# Altium schematic sheet NB2DSK01.SchDoc: NANOBOARD 2 - DESKTOP
size A3; Organization: Altium Limited.; Address1: Level 3, 12a Rodborough Rd; Address2: Frenchs Forest 2086; Address3: NSW; Address4: AUSTRALIA; DocumentNumber: 1; Revision: 6; SheetNumber: 1; SheetTotal: 64; PageSetup: Record=PageOptions|CenterHorizontal=True|CenterVertical=True|PrintScale=0.67|XCorrection=1.00|YCorrection=1.00|PrintKind=0|BorderSize=5000000|LeftOffset=0|BottomOffset=0|Orientation=1|PaperLength=4200|PaperWidth=2969|Scale=100|PaperSource=7|PrintQuality=1200|MediaType=1|DitherType=10|PaperKind=A4 (210 x 297 mm)|PrintScaleMode=1
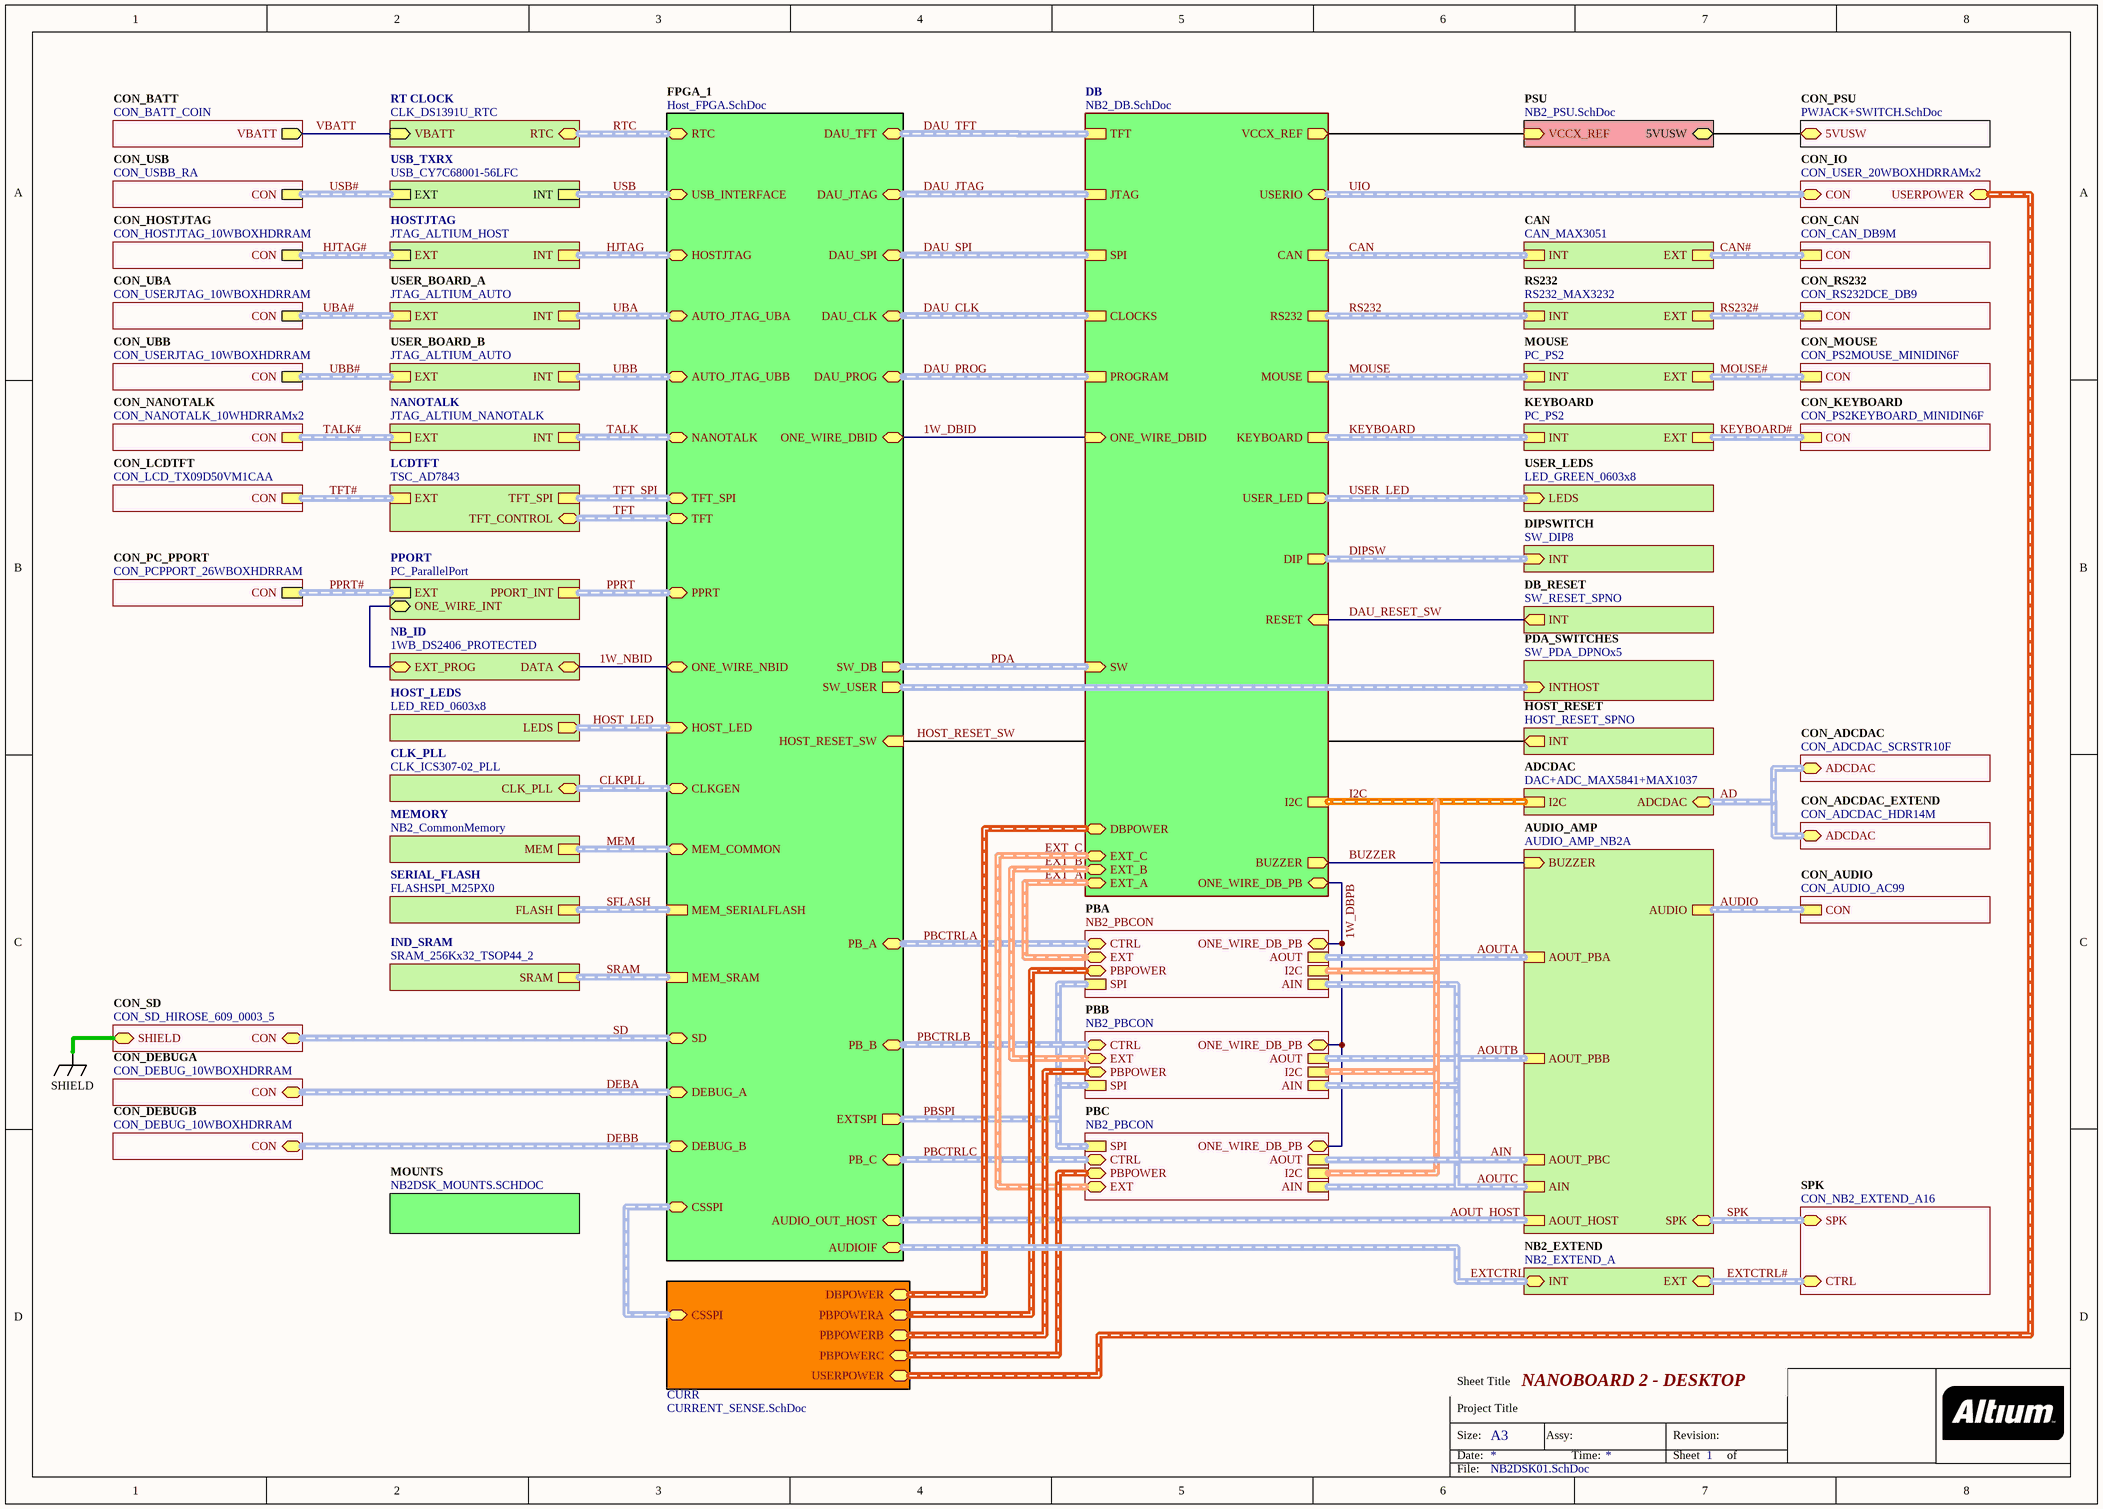
[diagram p0: NB2DSK01.SchDoc]

## Sub-sheets
ADCDAC = DAC+ADC_MAX5841+MAX1037: I2C (harness I2C), ADCDAC (harness ADCDAC)
AUDIO_AMP = AUDIO_AMP_NB2A: BUZZER (in), AIN (harness AUDIO_IN), AOUT_PBC (harness AUDIO_OUT), AOUT_PBA (harness AUDIO_OUT), AOUT_PBB (harness AUDIO_OUT), AOUT_HOST (harness AUDIO_OUT), AUDIO (harness AUDIO_EXT), SPK (harness NB2_SPEAKER)
CAN = CAN_MAX3051: EXT (harness CAN_EXT), INT (harness CAN_INT)
CLK_PLL = CLK_ICS307-02_PLL: CLK_PLL (harness CLK_PLL)
CON_ADCDAC = CON_ADCDAC_SCRSTR10F: ADCDAC (harness ADCDAC)
CON_ADCDAC_EXTEND = CON_ADCDAC_HDR14M: ADCDAC (harness ADCDAC)
CON_AUDIO = CON_AUDIO_AC99: CON (harness AUDIO_EXT)
CON_BATT = CON_BATT_COIN: VBATT (out)
CON_CAN = CON_CAN_DB9M: CON (harness CAN_EXT)
CON_DEBUGA = CON_DEBUG_10WBOXHDRRAM: CON (harness DBHDR)
CON_DEBUGB = CON_DEBUG_10WBOXHDRRAM: CON (harness DBHDR)
CON_HOSTJTAG = CON_HOSTJTAG_10WBOXHDRRAM: CON (harness HARDSOFT_JTAG)
CON_IO = CON_USER_20WBOXHDRRAMx2: CON (harness IO36), USERPOWER (harness USERPOWER)
CON_KEYBOARD = CON_PS2KEYBOARD_MINIDIN6F: CON (harness PS2)
CON_LCDTFT = CON_LCD_TX09D50VM1CAA: CON (harness LCD)
CON_MOUSE = CON_PS2MOUSE_MINIDIN6F: CON (harness PS2)
CON_NANOTALK = CON_NANOTALK_10WHDRRAMx2: CON (harness NANOTALK)
CON_PC_PPORT = CON_PCPPORT_26WBOXHDRRAM: CON (harness PPORT_CON)
CON_PSU = PWJACK+SWITCH.SchDoc: 5VUSW (bidir)
CON_RS232 = CON_RS232DCE_DB9: CON (harness RS232_EXT)
CON_SD = CON_SD_HIROSE_609_0003_5: CON (harness SD), SHIELD
CON_UBA = CON_USERJTAG_10WBOXHDRRAM: CON (harness JTAG_CONFIG)
CON_UBB = CON_USERJTAG_10WBOXHDRRAM: CON (harness JTAG_CONFIG)
CON_USB = CON_USBB_RA: CON (harness USB_CON)
CURR = CURRENT_SENSE.SchDoc: PBPOWERA (harness PBPOWER), PBPOWERB (harness PBPOWER), PBPOWERC (harness PBPOWER), DBPOWER (harness DBPOWER), CSSPI (harness CS_SPI), USERPOWER (harness USERPOWER)
DB = NB2_DB.SchDoc: RESET (in), BUZZER (out), DIP (harness SW8), USER_LED (harness LED8), USERIO (harness IO36), VCCX_REF (out), ONE_WIRE_DB_PB (bidir), I2C (harness I2C), CAN (harness CAN_INT), RS232 (harness RS232_INT), KEYBOARD (harness PS2), MOUSE (harness PS2), SW (harness SW5), EXT_A (harness PBIO), EXT_B (harness PBIO), EXT_C (harness PBIO), TFT (harness DAU_TFT), JTAG (harness HardSoft_JTAG), PROGRAM (harness DAU_CTRL), SPI (harness DAU_SPI), CLOCKS (harness DAU_CLK), DBPOWER (harness DBPOWER), ONE_WIRE_DBID (in)
DB_RESET = SW_RESET_SPNO: INT (out)
DIPSWITCH = SW_DIP8: INT (harness SW8)
FPGA_1 = Host_FPGA.SchDoc: CLKGEN (harness CLK_PLL), HOST_LED (harness LED8), SW_USER (harness SW5), HOST_RESET_SW (in), DEBUG_A (harness DBHDR), DEBUG_B (harness DBHDR), ONE_WIRE_DBID (bidir), ONE_WIRE_NBID (bidir), EXTSPI (harness EXTSPI), PB_A (harness PBCTRL), PB_B (harness PBCTRL), PB_C (harness PBCTRL), AUDIO_OUT_HOST (harness AUDIO_OUT), AUTO_JTAG_UBA (harness JTAG_CONFIG), AUTO_JTAG_UBB (harness JTAG_CONFIG), SD (harness SD), NANOTALK (harness NANOTALK), TFT_SPI (harness TFT_SPI), DAU_TFT (harness DAU_TFT), DAU_JTAG (harness HARDSOFT_JTAG), DAU_PROG (harness DAU_CTRL), DAU_SPI (harness DAU_SPI), DAU_CLK (harness DAU_CLK), MEM_COMMON (harness HOSTMEMORY), USB_INTERFACE (harness USB_INTF), HOSTJTAG (harness HARDSOFT_JTAG), PPRT (harness PPORT_INTF), RTC (harness RTC), MEM_SERIALFLASH (harness SERIALFLASH), MEM_SRAM (harness SRAM_2), CSSPI (harness CS_SPI), AUDIOIF (harness AUDIOIF), SW_DB (harness SW5), TFT (harness TFT)
HOST_LEDS = LED_RED_0603x8: LEDS (harness LED8)
HOST_RESET = HOST_RESET_SPNO: INT (out)
HOSTJTAG = JTAG_ALTIUM_HOST: EXT (harness HARDSOFT_JTAG), INT (harness HARDSOFT_JTAG)
IND_SRAM = SRAM_256Kx32_TSOP44_2: SRAM (harness SRAM_2)
KEYBOARD = PC_PS2: EXT (harness PS2), INT (harness PS2)
LCDTFT = TSC_AD7843: EXT (harness LCD), TFT_SPI (harness TFT_SPI), TFT_CONTROL (harness TFT)
MEMORY = NB2_CommonMemory: MEM (harness HOSTMEMORY)
MOUNTS = NB2DSK_MOUNTS.SCHDOC: no entries
MOUSE = PC_PS2: EXT (harness PS2), INT (harness PS2)
NANOTALK = JTAG_ALTIUM_NANOTALK: EXT (harness NANOTALK), INT (harness NANOTALK)
NB2_EXTEND = NB2_EXTEND_A: INT (harness AUDIOIF), EXT (harness AUDIOIF)
NB_ID = 1WB_DS2406_PROTECTED: DATA (bidir), EXT_PROG (bidir)
PBA = NB2_PBCON: EXT (harness PBIO), ONE_WIRE_DB_PB (bidir), AIN (harness AUDIO_IN), I2C (harness I2C), SPI (harness EXTSPI), AOUT (harness AUDIO_OUT), CTRL (harness PBCTRL), PBPOWER (harness PBPOWER)
PBB = NB2_PBCON: EXT (harness PBIO), ONE_WIRE_DB_PB (bidir), AIN (harness AUDIO_IN), I2C (harness I2C), SPI (harness EXTSPI), AOUT (harness AUDIO_OUT), CTRL (harness PBCTRL), PBPOWER (harness PBPOWER)
PBC = NB2_PBCON: EXT, ONE_WIRE_DB_PB (bidir), AIN (harness AUDIO_IN), I2C (harness I2C), SPI (harness EXTSPI), AOUT (harness AUDIO_OUT), CTRL (harness PBCTRL), PBPOWER (harness PBPOWER)
PDA_SWITCHES = SW_PDA_DPNOx5: INTHOST (harness SW5)
PPORT = PC_ParallelPort: PPORT_INT (harness PPORT_INTF), EXT (harness PPORT_CON), ONE_WIRE_INT (bidir)
PSU = NB2_PSU.SchDoc: VCCX_REF (in), 5VUSW (bidir)
RS232 = RS232_MAX3232: INT (harness RS232_INT), EXT (harness RS232_EXT)
RT CLOCK = CLK_DS1391U_RTC: VBATT (in), RTC (harness RTC)
SERIAL_FLASH = FLASHSPI_M25PX0: FLASH (harness SERIALFLASH)
SPK = CON_NB2_EXTEND_A16: CTRL (harness AUDIOIF), SPK (harness NB2_SPEAKER)
USB_TXRX = USB_CY7C68001-56LFC: EXT (harness USB_CON), INT (harness USB_INTF)
USER_BOARD_A = JTAG_ALTIUM_AUTO: EXT (harness JTAG_CONFIG), INT (harness JTAG_CONFIG)
USER_BOARD_B = JTAG_ALTIUM_AUTO: EXT (harness JTAG_CONFIG), INT (harness JTAG_CONFIG)
USER_LEDS = LED_GREEN_0603x8: LEDS (harness LED8)

## Nets
SHIELD: sheet CON_SD/SHIELD
1W_DBID: sheet FPGA_1/ONE_WIRE_DBID, sheet DB/ONE_WIRE_DBID
1W_DBPB: sheet PBA/ONE_WIRE_DB_PB, sheet PBC/ONE_WIRE_DB_PB, sheet PBB/ONE_WIRE_DB_PB, sheet DB/ONE_WIRE_DB_PB
1W_NBID: sheet FPGA_1/ONE_WIRE_NBID, sheet NB_ID/DATA
BUZZER: sheet AUDIO_AMP/BUZZER, sheet DB/BUZZER
DAU_RESET_SW: sheet DB_RESET/INT, sheet DB/RESET
HOST_RESET_SW: sheet FPGA_1/HOST_RESET_SW, sheet HOST_RESET/INT
VBATT: sheet CON_BATT/VBATT, sheet RT CLOCK/VBATT
(unnamed): sheet PSU/VCCX_REF, sheet DB/VCCX_REF
(unnamed): sheet PSU/5VUSW, sheet CON_PSU/5VUSW
(unnamed): sheet PPORT/ONE_WIRE_INT, sheet NB_ID/EXT_PROG

## Buses and harness runs
harness AD = sheet ADCDAC/ADCDAC = sheet CON_ADCDAC/ADCDAC = sheet CON_ADCDAC_EXTEND/ADCDAC
harness AIN = sheet AUDIO_AMP/AOUT_PBC = sheet PBC/AOUT
harness AOUT_HOST = sheet AUDIO_AMP/AOUT_HOST = sheet FPGA_1/AUDIO_OUT_HOST
harness AOUTA = sheet AUDIO_AMP/AOUT_PBA = sheet PBA/AOUT
harness AOUTB = sheet AUDIO_AMP/AOUT_PBB = sheet PBB/AOUT
harness AOUTC = sheet AUDIO_AMP/AIN = sheet PBA/AIN = sheet PBB/AIN = sheet PBC/AIN
harness AUDIO = sheet AUDIO_AMP/AUDIO = sheet CON_AUDIO/CON
harness CAN = sheet CAN/INT = sheet DB/CAN
harness CAN# = sheet CAN/EXT = sheet CON_CAN/CON
harness CLKPLL = sheet CLK_PLL/CLK_PLL = sheet FPGA_1/CLKGEN
harness DAU_CLK = sheet DB/CLOCKS = sheet FPGA_1/DAU_CLK
harness DAU_JTAG = sheet DB/JTAG = sheet FPGA_1/DAU_JTAG
harness DAU_PROG = sheet DB/PROGRAM = sheet FPGA_1/DAU_PROG
harness DAU_SPI = sheet DB/SPI = sheet FPGA_1/DAU_SPI
harness DAU_TFT = sheet DB/TFT = sheet FPGA_1/DAU_TFT
harness DEBA = sheet CON_DEBUGA/CON = sheet FPGA_1/DEBUG_A
harness DEBB = sheet CON_DEBUGB/CON = sheet FPGA_1/DEBUG_B
harness DIPSW = sheet DB/DIP = sheet DIPSWITCH/INT
harness EXT_A = sheet DB/EXT_A = sheet PBA/EXT
harness EXT_B = sheet DB/EXT_B = sheet PBB/EXT
harness EXT_C = sheet DB/EXT_C = sheet PBC/EXT
harness EXTCTRL = sheet FPGA_1/AUDIOIF = sheet NB2_EXTEND/INT
harness EXTCTRL# = sheet NB2_EXTEND/EXT = sheet SPK/CTRL
harness HJTAG = sheet FPGA_1/HOSTJTAG = sheet HOSTJTAG/INT
harness HJTAG# = sheet CON_HOSTJTAG/CON = sheet HOSTJTAG/EXT
harness HOST_LED = sheet FPGA_1/HOST_LED = sheet HOST_LEDS/LEDS
harness I2C = sheet ADCDAC/I2C = sheet DB/I2C = sheet PBA/I2C = sheet PBB/I2C = sheet PBC/I2C
harness KEYBOARD = sheet DB/KEYBOARD = sheet KEYBOARD/INT
harness KEYBOARD# = sheet CON_KEYBOARD/CON = sheet KEYBOARD/EXT
harness MEM = sheet FPGA_1/MEM_COMMON = sheet MEMORY/MEM
harness MOUSE = sheet DB/MOUSE = sheet MOUSE/INT
harness MOUSE# = sheet CON_MOUSE/CON = sheet MOUSE/EXT
harness PBCTRLA = sheet FPGA_1/PB_A = sheet PBA/CTRL
harness PBCTRLB = sheet FPGA_1/PB_B = sheet PBB/CTRL
harness PBCTRLC = sheet FPGA_1/PB_C = sheet PBC/CTRL
harness PBSPI = sheet FPGA_1/EXTSPI = sheet PBA/SPI = sheet PBB/SPI = sheet PBC/SPI
harness PDA = sheet DB/SW = sheet FPGA_1/SW_DB
harness PPRT = sheet FPGA_1/PPRT = sheet PPORT/PPORT_INT
harness PPRT# = sheet CON_PC_PPORT/CON = sheet PPORT/EXT
harness RS232 = sheet DB/RS232 = sheet RS232/INT
harness RS232# = sheet CON_RS232/CON = sheet RS232/EXT
harness RTC = sheet FPGA_1/RTC = sheet RT CLOCK/RTC
harness SD = sheet CON_SD/CON = sheet FPGA_1/SD
harness SFLASH = sheet FPGA_1/MEM_SERIALFLASH = sheet SERIAL_FLASH/FLASH
harness sheet CON_IO/USERPOWER = sheet CURR/USERPOWER
harness sheet CURR/CSSPI = sheet FPGA_1/CSSPI
harness sheet CURR/DBPOWER = sheet DB/DBPOWER
harness sheet CURR/PBPOWERA = sheet PBA/PBPOWER
harness sheet CURR/PBPOWERB = sheet PBB/PBPOWER
harness sheet CURR/PBPOWERC = sheet PBC/PBPOWER
harness sheet FPGA_1/SW_USER = sheet PDA_SWITCHES/INTHOST
harness SPK = sheet AUDIO_AMP/SPK = sheet SPK/SPK
harness SRAM = sheet FPGA_1/MEM_SRAM = sheet IND_SRAM/SRAM
harness TALK = sheet FPGA_1/NANOTALK = sheet NANOTALK/INT
harness TALK# = sheet CON_NANOTALK/CON = sheet NANOTALK/EXT
harness TFT = sheet FPGA_1/TFT = sheet LCDTFT/TFT_CONTROL
harness TFT# = sheet CON_LCDTFT/CON = sheet LCDTFT/EXT
harness TFT_SPI = sheet FPGA_1/TFT_SPI = sheet LCDTFT/TFT_SPI
harness UBA = sheet FPGA_1/AUTO_JTAG_UBA = sheet USER_BOARD_A/INT
harness UBA# = sheet CON_UBA/CON = sheet USER_BOARD_A/EXT
harness UBB = sheet FPGA_1/AUTO_JTAG_UBB = sheet USER_BOARD_B/INT
harness UBB# = sheet CON_UBB/CON = sheet USER_BOARD_B/EXT
harness UIO = sheet CON_IO/CON = sheet DB/USERIO
harness USB = sheet FPGA_1/USB_INTERFACE = sheet USB_TXRX/INT
harness USB# = sheet CON_USB/CON = sheet USB_TXRX/EXT
harness USER_LED = sheet DB/USER_LED = sheet USER_LEDS/LEDS

## Notes on the sheet
- Sheet Title
- Project Title
- Size:
- Date:
- A3
- Assy:
- Time:
- Revision:
- Sheet
- of
- File: